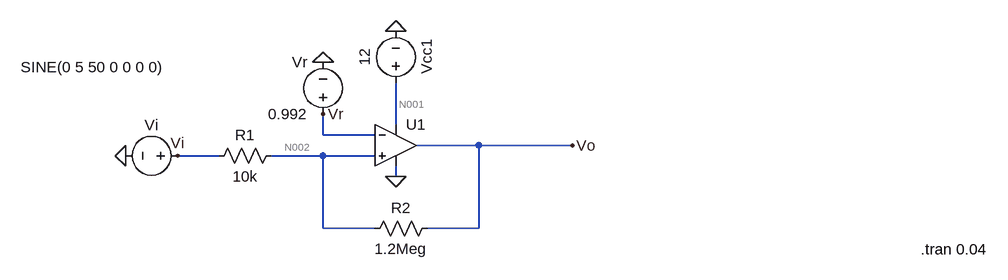
[diagram p0: schematic Draft2.asc]
Draft2.asc, the LTspice schematic file:
Version 4.1
SHEET 1 988 680
WIRE 64 128 64 64
WIRE -48 144 -48 112
WIRE 32 144 -48 144
WIRE 192 160 96 160
WIRE 336 160 192 160
WIRE -208 176 -272 176
WIRE -48 176 -128 176
WIRE 32 176 -48 176
WIRE 64 208 64 192
WIRE -48 288 -48 176
WIRE 32 288 -48 288
WIRE 192 288 192 160
WIRE 192 288 112 288
FLAG -352 176 0
FLAG 336 160 Vo
FLAG 64 -16 0
FLAG -272 176 Vi
FLAG 64 208 0
FLAG -48 112 Vr
FLAG -48 32 0
SYMBOL voltage -256 176 R90
WINDOW 0 -32 56 VBottom 2
WINDOW 3 -152 147 VTop 2
WINDOW 123 0 0 Left 0
WINDOW 39 0 0 Left 0
SYMATTR InstName Vi
SYMATTR Value SINE(0 5 50 0 0 0 0)
SYMBOL res 128 272 R90
WINDOW 0 0 56 VBottom 2
WINDOW 3 32 56 VTop 2
SYMATTR InstName R2
SYMATTR Value 1.2Meg
SYMBOL voltage 64 80 R180
WINDOW 0 -32 56 VBottom 2
WINDOW 3 32 56 VTop 2
WINDOW 123 0 0 Left 0
WINDOW 39 0 0 Left 0
SYMATTR InstName Vcc1
SYMATTR Value 12
SYMBOL OpAmps\\UniversalOpAmp2 64 160 R0
SYMATTR InstName U1
SYMBOL res -112 160 R90
WINDOW 0 0 56 VBottom 2
WINDOW 3 32 56 VTop 2
SYMATTR InstName R1
SYMATTR Value 10k
SYMBOL voltage -48 128 R180
WINDOW 0 24 96 Left 2
WINDOW 3 24 16 Left 2
WINDOW 123 0 0 Left 0
WINDOW 39 0 0 Left 0
SYMATTR InstName Vr
SYMATTR Value 0.992
TEXT 872 320 Left 2 !.tran 0.04

The netlist it stands for:
* Draft2.asc
Vi Vi 0 SINE(0 5 50 0 0 0 0)
R2 Vo N002 1.2Meg
Vcc1 N001 0 12
X§U1 N002 Vr N001 0 Vo level2 Avol=1Meg GBW=10Meg Slew=10Meg Ilimit=25m Rail=0 Vos=0 En=0 Enk=0 In=0 Ink=0 Rin=500Meg  ; pins In+ In- V+ V- OUT
R1 N002 Vi 10k
Vr Vr 0 0.992
.tran 0.04
.lib UniversalOpAmp2.lib
.backanno
.end

* Results of the author's LTspice run, read from the files saved beside the schematic
* Operating Point, zero values left out:
*   V(n001) = 12 V
*   V(n002) = 119.1 µV
*   V(vo) = 12.87 µV
*   V(vr) = 992 mV
*   I(R1) = 11.91 nA
*   I(R2) = -88.53 pA
*   I(Vcc1) = -1.389 µA
*   I(Vi) = 11.91 nA
*   I(Vr) = 10.02 nA
*   Ix(u1:1) = -12 nA
*   Ix(u1:2) = -10.02 nA
*   Ix(u1:3) = 1.389 µA
*   Ix(u1:4) = -1.181 µA
*   Ix(u1:5) = 88.53 pA
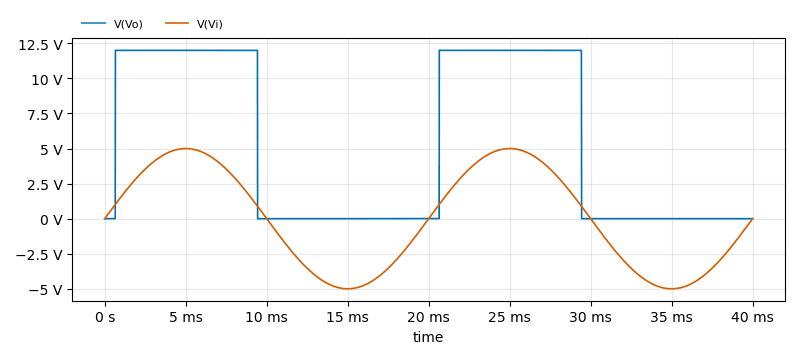
[diagram p1: Transient Analysis of Draft2.asc, plotted from the saved traces]
* Transient Analysis, 1 run:
*   V(Vo): min -34.63 µV, max 12 V, average 5.27 V, rms 7.951 V, last 8.17 µV
*   V(Vi): min -5 V, max 5 V, average 0 V, rms 3.536 V, last 0 V